# EAGLE design femto (EAGLE 6.4)
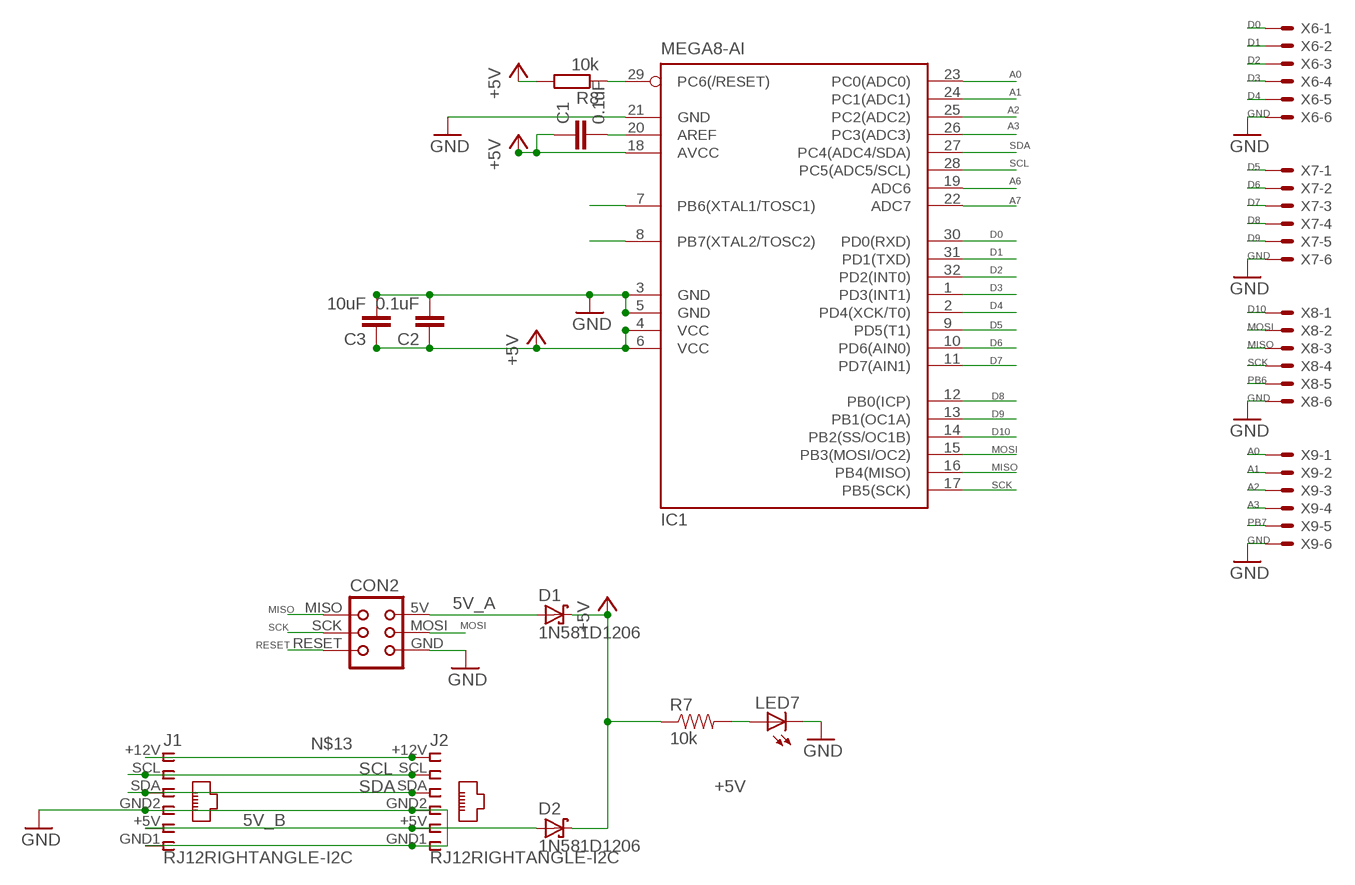
[diagram p0: schematic, sheet 1]

## Parts
C1  0.1uF  C-EUC1206  [C1206]
C2  0.1uF  C-EUC1206  [C1206]
C3  10uF  C-EUC1206  [C1206]
CON2  TINYISPTAG  [TC2030-MCP]
D1  1N581D1206  [LED-1206]
D2  1N581D1206  [LED-1206]
IC1  MEGA8-AI  [TQFP32-08]
J1  RJ12RIGHTANGLE-I2C  [RJ12-RIGHTANGLE-I2C]
J2  RJ12RIGHTANGLE-I2C  [RJ12-RIGHTANGLE-I2C]
LED7  LEDCHIP-LED0603  [CHIP-LED0603]
R7  10k  RESISTOR0603-RES  [0603-RES]
R8  10k  R-EU_M1206  [M1206]
X6  22-23-2061  [22-23-2061]
X7  22-23-2061  [22-23-2061]
X8  22-23-2061  [22-23-2061]
X9  22-23-2061  [22-23-2061]

## Nets
5V_A [i2c]: CON2.5V(VCC) D1.A
5V_B [power]: D2.A J1.+5V J2.+5V
+5V [power]: C1.1 C2.1 C3.1 D1.C D2.C IC1.4(VCC) IC1.6(VCC) IC1.18(AVCC) R7.1 R8.2
A0: IC1.23(PC0(ADC0)) X9.1
A1: IC1.24(PC1(ADC1)) X9.2
A2: IC1.25(PC2(ADC2)) X9.3
A3: IC1.26(PC3(ADC3)) X9.4
A6: IC1.19(ADC6)
A7: IC1.22(ADC7)
D0: IC1.30(PD0(RXD)) X6.1
D1: IC1.31(PD1(TXD)) X6.2
D2: IC1.32(PD2(INT0)) X6.3
D3: IC1.1(PD3(INT1)) X6.4
D4: IC1.2(PD4(XCK/T0)) X6.5
D5: IC1.9(PD5(T1)) X7.1
D6: IC1.10(PD6(AIN0)) X7.2
D7: IC1.11(PD7(AIN1)) X7.3
D8: IC1.12(PB0(ICP)) X7.4
D9: IC1.13(PB1(OC1A)) X7.5
D10: IC1.14(PB2(SS/OC1B)) X8.1
GND [power]: C2.2 C3.2 CON2.GND IC1.3(GND) IC1.5(GND) IC1.21(GND) J1.GND1 J1.GND2 J2.GND1 J2.GND2 LED7.C X6.6 X7.6 X8.6 X9.6
MISO: CON2.MISO IC1.16(PB4(MISO)) X8.3
MOSI: CON2.MOSI IC1.15(PB3(MOSI/OC2)) X8.2
N$4: C1.2 IC1.20(AREF)
N$13: J1.+12V J2.+12V
N$15: LED7.A R7.2
PB6: IC1.7(PB6(XTAL1/TOSC1)) X8.5
PB7: IC1.8(PB7(XTAL2/TOSC2)) X9.5
RESET: CON2.RESET IC1.29(PC6(/RESET)) R8.1
SCK: CON2.SCK IC1.17(PB5(SCK)) X8.4
SCL [i2c]: IC1.28(PC5(ADC5/SCL)) J1.SCL J2.SCL
SDA [i2c]: IC1.27(PC4(ADC4/SDA)) J1.SDA J2.SDA

## Library data of the parts
C1-C3 = resistor:C-EU: CAPACITOR, European symbol
CON2 = lpatiny:TINYISP: CONNECTOR
D1 D2 = lpatiny:1N581*: 1.0A SCHOTTKY BARRIER RECTIFIER Source: http://www.diodes.com/datasheets/ds23001.pdf
IC1 = atmel:MEGA8: MICROCONTROLLER 8 Kbytes FLASH, 1 kbytes SRAM, 512 bytes EEPROM, USART, 6-channel 10 bit ADC, 2-channel 8 bit ADC Pin compatible with Atmega48, ATMega88, ATMega168 Source: avr.lbr; MPN: ATMEGA8-16AU; OC_FARNELL: 9171371; OC_NEWARK: 73M8863
J1 J2 = lpatiny:RJ12: CORCOM Modular RJ Jacks No Shield Source: www.tycoelectronics.com .. ENG_DS_1654001_1099_RJ_L_0507.pdf
LED7 = adafruit:LED: LED OSRAM: - CHIPLED LG R971, LG N971, LY N971, LG Q971, LY Q971, LO R971, LY R971 LH N974, LH R974 LS Q976, LO Q976, LY Q976 LO Q996 - Hyper CHIPLED LW Q18S LB Q993, LB Q99A, LB R99A - SideLED LS A670, LO A670, LY A670, LG A670, LP A670 LB A673, LV A673, LT A673, LW A673 LH A674 LY A675 LS A676, LA A676, LO A676, LY A676, LW A676 LS A679, LY A679, LG A679 - Hyper Micro SIDELED® LS Y876, LA Y876, LO Y876, LY Y876 LT Y87S - SmartLED LW L88C, LW L88S LB L89C, LB L89S, LG L890 LS L89K, LO L89K, LY L89K LS L896, LA L896, LO L896, LY L896 - TOPLED LS T670, LO T670, LY T670, LG T670, LP T670 LSG T670, LSP T670, LSY T670, LOP T670, LYG T670 LG T671, LOG T671, LSG T671 LB T673, LV T673, LT T673, LW T673 LH T674 LS T676, LA T676, LO T676, LY T676, LB T676, LH T676, LSB T676, LW T676 LB T67C, LV T67C, LT T67C, LS T67K, LO T67K, LY T67K, LW E67C LS E67B, LA E67B, LO E67B, LY E67B, LB E67C, LV E67C, LT E67C LW T67C LS T679, LY T679, LG T679 LS T770, LO T770, LY T770, LG T770, LP T770 LB T773, LV T773, LT T773, LW T773 LH T774 LS E675, LA E675, LY E675, LS T675 LS T776, LA T776, LO T776, LY T776, LB T776 LHGB T686 LT T68C, LB T68C - Hyper Mini TOPLED® LB M676 - Mini TOPLED Santana® LG M470 LS M47K, LO M47K, LY M47K Source: http://www.osram.convergy.de/
R7 = SparkFun:RESISTOR: Resistor Basic schematic elements and footprints for 0603, 1206, and PTH resistors.
R8 = resistor:R-EU_: RESISTOR, European symbol
X6-X9 = con-molex:22-23-2061: .100" (2.54mm) Center Header - 6 Pin; MF: MOLEX; MPN: 22-23-2061; OC_FARNELL: 1462922; OC_NEWARK: 27C1933

## Net classes
0 default: width 0.305 mm
1 power: width 0.457 mm
2 i2c: width 0.457 mm
3 fine: width 0.305 mm

## Board
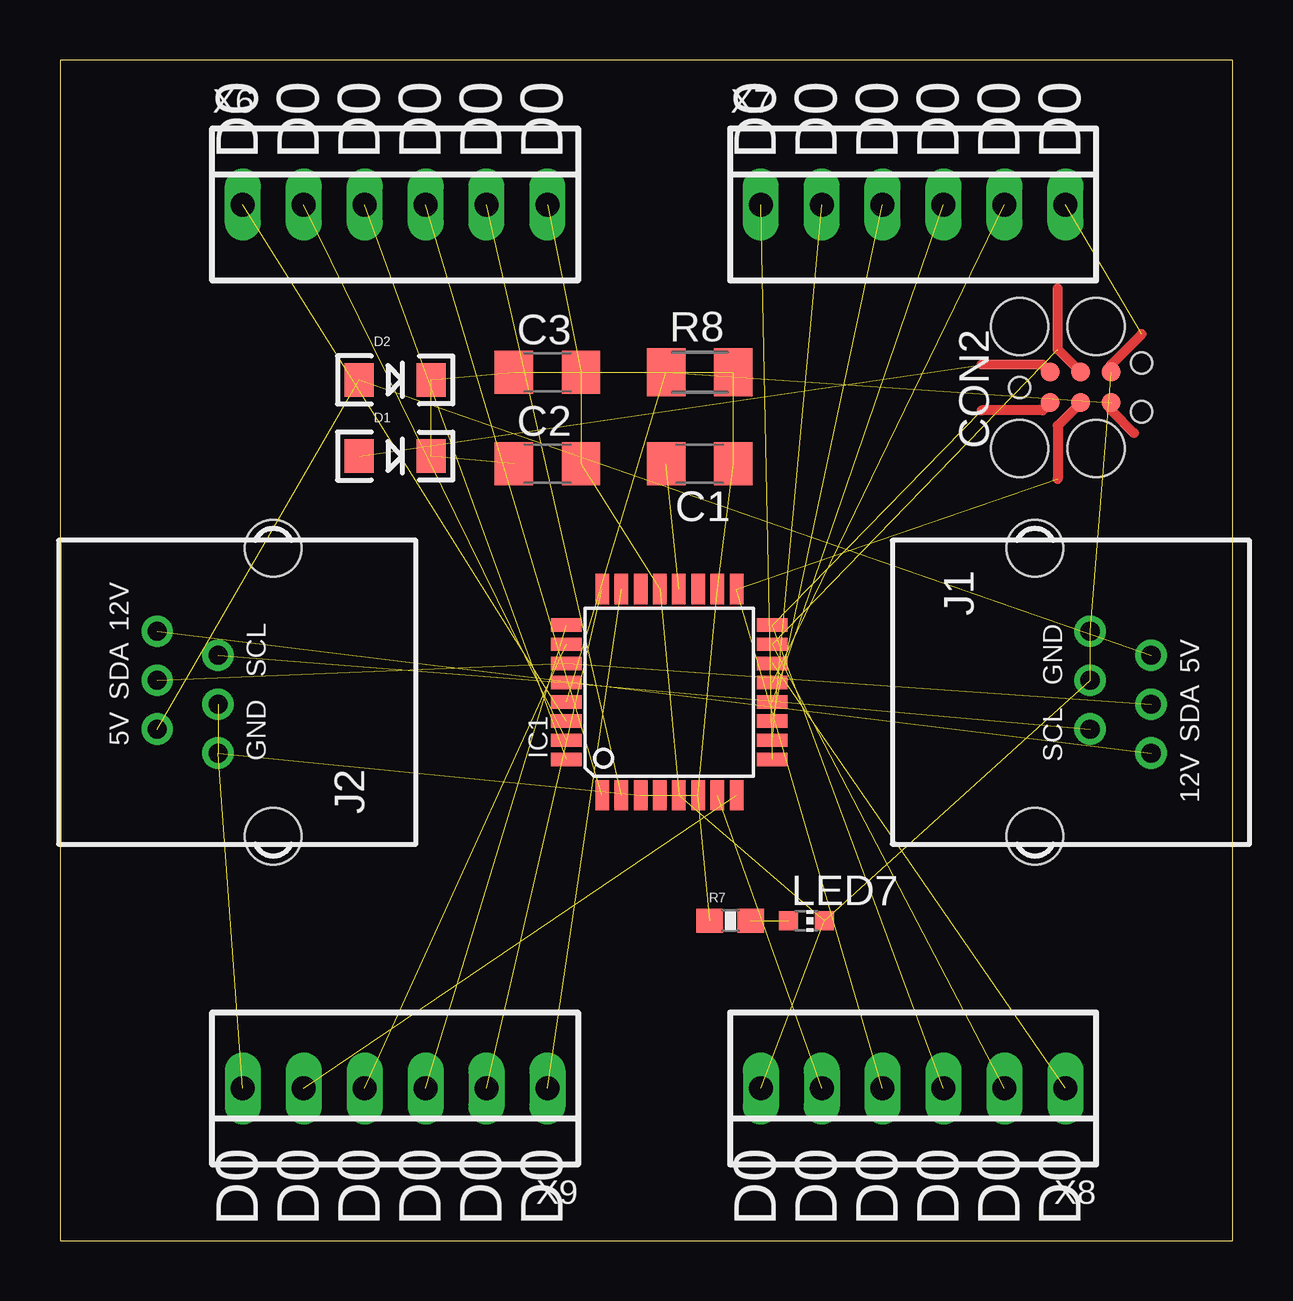
[diagram p1: board, top side]

Size 48.88 x 49.2 mm. Coordinates in mm from the lower left corner, seen from the top.
Outline: 0,0 48.88,0 48.88,49.2 0,49.2 0,0
Copper layers (1*16): Top 0.035mm / dielectric 1.5mm / Bottom 0.035mm
Design rules "Fusion_eagle_rule_v1.1": minimum track width 6mil, minimum drill 12mil, track to track 6mil, track to pad 6mil, pad to pad 6mil, via to via 6mil, smd to smd 0mil, copper to edge 10mil, drill to drill 10mil, minimum pad ring 10mil, minimum via ring 6mil, stop-mask expansion 2mil, vias tented up to drill 100mil, thermal gap 10mil
vRestrict: area 19,16.5 to 31.8,20.3; area 19,25.4 to 31.8,29.2; area 27.9,16.5 to 31.8,29.2; area 19,16.5 to 22.9,29.2; area 39.4,33 to 44.5,38.1

### Footprints (pad centres in the part's own frame; a part is rotated, then mirrored left to right if it is on the bottom)
C1206 = smd 1.6 x 1.8: 1 -1.4,0; 2 1.4,0
TC2030-MCP = smd 0.787 x 0.787: 5V 1.27,0.635; GND 3.81,0.635; MISO 1.27,-0.635; MOSI 2.54,0.635; RESET 3.81,-0.635; SCK 2.54,-0.635 | hole 0.889: 0,0; 5.08,-1.016; 5.08,1.016 | hole 2.375: 0,2.54; 0,-2.54; 3.175,-2.54; 3.175,2.54
LED-1206 = smd 1.2 x 1.4: A -1.5,0; C 1.5,0
TQFP32-08 = smd 1.27 x 0.559: 1 -4.293,2.8; 2 -4.293,2; 3 -4.293,1.2; 4 -4.293,0.4; 5 -4.293,-0.4; 6 -4.293,-1.2; 7 -4.293,-2; 8 -4.293,-2.8; 17 4.293,-2.8; 18 4.293,-2; 19 4.293,-1.2; 20 4.293,-0.4; 21 4.293,0.4; 22 4.293,1.2; 23 4.293,2; 24 4.293,2.8 | smd 0.559 x 1.27: 9 -2.8,-4.293; 10 -2,-4.293; 11 -1.2,-4.293; 12 -0.4,-4.293; 13 0.4,-4.293; 14 1.2,-4.293; 15 2,-4.293; 16 2.8,-4.293; 25 2.8,4.293; 26 2,4.293; 27 1.2,4.293; 28 0.4,4.293; 29 -0.4,4.293; 30 -1.2,4.293; 31 -2,4.293; 32 -2.8,4.293
RJ12-RIGHTANGLE-I2C = drill 0.8 pad 1.3: +5V -1.54,4.84; +12V 2.54,4.84; GND1 -2.54,2.3; GND2 -0.5,2.3; SCL 1.54,2.3; SDA 0.5,4.84 | hole 2.36: -6,0; 6,0
CHIP-LED0603 = smd 0.8 x 0.8: A 0,-0.75; C 0,0.75
0603-RES = smd 1.1 x 1: 1 -0.85,0; 2 0.85,0
M1206 = smd 1.6 x 2: 1 -1.4,0; 2 1.4,0
22-23-2061 = drill 1 long: 1 -6.35,0; 2 -3.81,0; 3 -1.27,0; 4 1.27,0; 5 3.81,0; 6 6.35,0

### Placement (x,y rotation side)
C1  26.67,32.38 180 top
C2  20.32,32.38 0 top
C3  20.32,36.2 0 top
CON2  40.01,35.56 0 top
D1  13.97,32.7 0 top
D2  13.97,35.88 0 top
IC1  25.4,22.86 90 top
J1  40.64,22.86 270 top
J2  8.89,22.86 90 top
LED7  31.11,13.34 270 top
R7  27.94,13.34 0 top
R8  26.67,36.2 0 top
X6  13.97,43.18 0 top
X7  35.56,43.18 0 top
X8  35.56,6.35 180 top
X9  13.97,6.35 180 top

### Tracks (layer width: path | path; a pad name or v marks a point on that pad's centre or on a via)
5V_A  (1 unrouted)
  Top 0.406: CON2.5V 40.96,36.51 38.42,36.51
5V_B  (2 unrouted)
+5V  (9 unrouted)
A0  (1 unrouted)
A1  (1 unrouted)
A2  (1 unrouted)
A3  (1 unrouted)
D0  (1 unrouted)
D1  (1 unrouted)
D2  (1 unrouted)
D3  (1 unrouted)
D4  (1 unrouted)
D5  (1 unrouted)
D6  (1 unrouted)
D7  (1 unrouted)
D8  (1 unrouted)
D9  (1 unrouted)
D10  (1 unrouted)
GND  (14 unrouted)
  Top 0.406: CON2.GND 43.81,36.51 45.09,37.78
MISO  (2 unrouted)
  Top 0.406: CON2.MISO 40.96,34.61 38.42,34.61
MOSI  (2 unrouted)
  Top 0.406: CON2.MOSI 41.59,37.15 41.59,39.69
N$4  (1 unrouted)
N$13  (1 unrouted)
N$15  (1 unrouted)
PB6  (1 unrouted)
PB7  (1 unrouted)
RESET  (2 unrouted)
  Top 0.406: CON2.RESET 43.81,34.61 44.77,33.66
SCK  (2 unrouted)
  Top 0.406: CON2.SCK 41.59,33.97 41.59,31.75
SCL  (2 unrouted)
SDA  (2 unrouted)

### Text on the board
tNames: D0 | D0 | D0 | D0 | D0 | D0 | D0 | D0 | D0 | D0 | D0 | D0 | D0 | D0 | D0 | D0 | D0 | D0 | D0 | D0 | D0 | D0 | D0 | D0